# Altium schematic sheet STM32_DEV_Board_Connectors.SchDoc: STM32_DEV_Board_Connectors
size B; Organization: Myomo; Address1: 137 PORTLAND STREET, 4TH FLOOR; Address2: BOSTON, MA 02114; Address3: USA; SheetNumber: 6
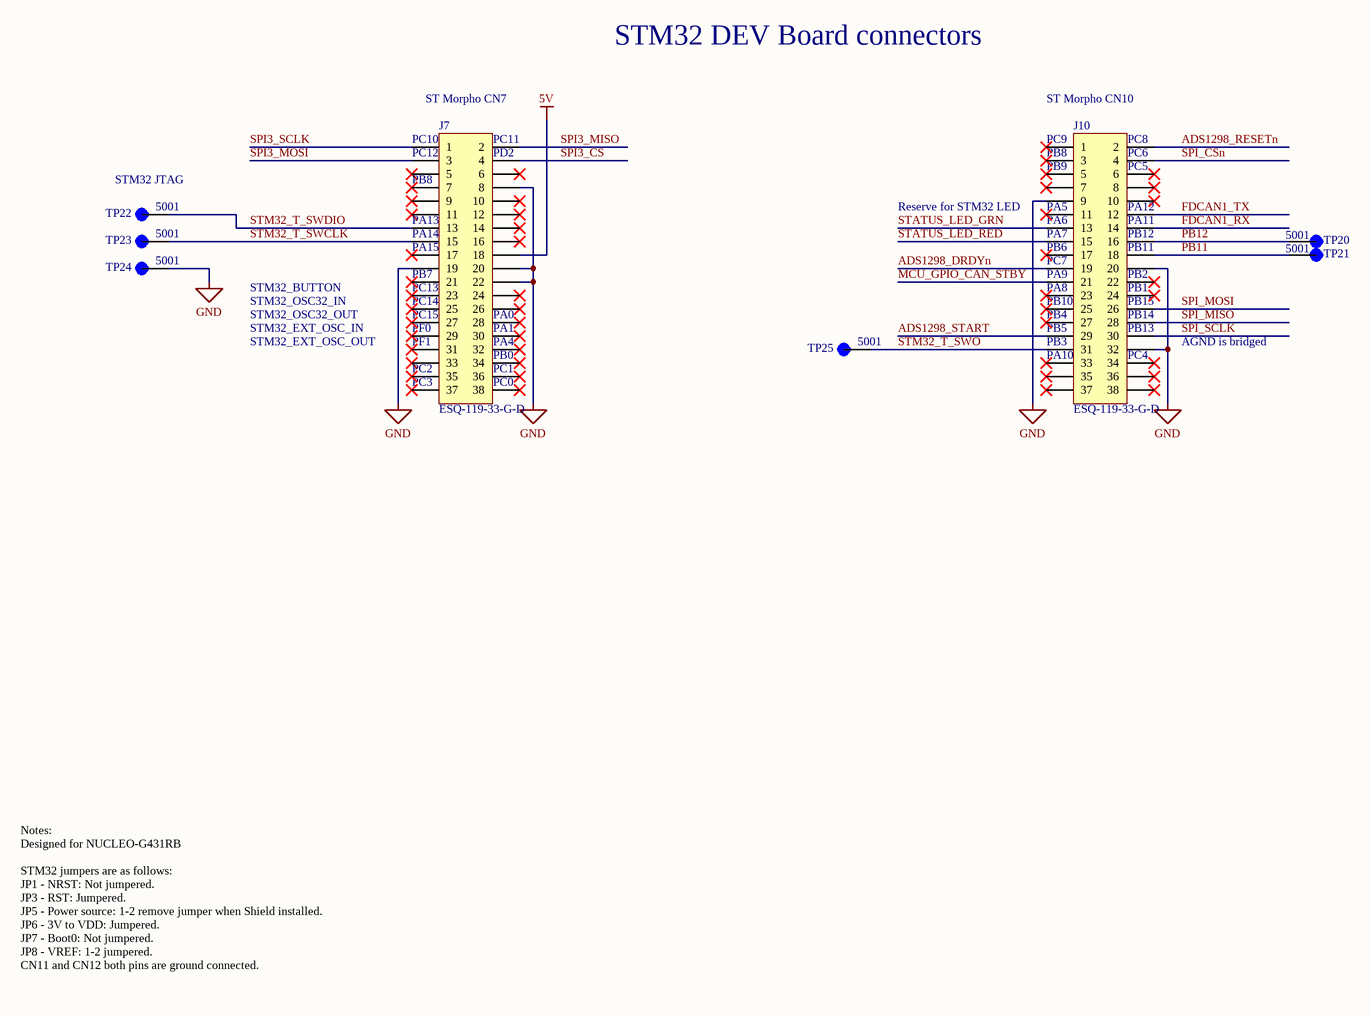
[diagram p0: STM32_DEV_Board_Connectors.SchDoc]

## Parts
J7  ESQ-119-33-G-D  [J_SAMTEC_ESQ-119-33-G-D]
J10  ESQ-119-33-G-D  [J_SAMTEC_ESQ-119-33-G-D]
TP20  5001  [TP_CLIP_BLK_5001]
TP21  5001  [TP_CLIP_BLK_5001]
TP22  5001  [TP_CLIP_BLK_5001]
TP23  5001  [TP_CLIP_BLK_5001]
TP24  5001  [TP_CLIP_BLK_5001]
TP25  5001  [TP_CLIP_BLK_5001]

## Nets
5V: J7.18
GND: J7.8 J7.19 J7.20 J7.22 J10.9 J10.20 J10.32 TP24.TP
ADS1298_DRDYn: J10.19
ADS1298_RESETn: J10.2
ADS1298_START: J10.29
FDCAN1_RX: J10.14
FDCAN1_TX: J10.12
MCU_GPIO_CAN_STBY: J10.21
PB11: J10.18 TP21.TP
PB12: J10.16 TP20.TP
SPI3_CS: J7.4
SPI3_MISO: J7.2
SPI3_MOSI: J7.3
SPI3_SCLK: J7.1
SPI_CSn: J10.4
SPI_MISO: J10.28
SPI_MOSI: J10.26
SPI_SCLK: J10.30
STATUS_LED_GRN: J10.13
STATUS_LED_RED: J10.15
STM32_T_SWCLK: J7.15 TP23.TP
STM32_T_SWDIO: J7.13 TP22.TP
STM32_T_SWO: J10.31 TP25.TP

Not connected (* = marked no-connect by the designer): J7 5* 6* 7* 9* 10* 11* 12* 14* 16* 17* 21* 23* 24* 25* 26* 27* 28* 29* 30* 31* 32* 33* 34* 35* 36* 37* 38*; J10 1* 3* 5* 6* 7* 8* 10* 11* 17* 22* 23* 24* 25* 27* 33* 34* 35* 36* 37* 38*

## Notes on the sheet
- STM32 DEV Board connectors
- (near J7) ST Morpho CN7
- (near J10) ST Morpho CN10
- (near TP22) STM32 JTAG
- (near J7) PC10
- (near J7) PC12
- (near J7) PB8
- (near J7) PC11
- (near J7) PD2
- (near J10) PC9
- (near J10) PB8
- (near J10) PB9
- (near J10) PC6
- (near J10) PC8
- (near J10) PC5
- (near J7) PA13
- (near J7) PA14
- (near J7) PA15
- (near J10) Reserve for STM32 LED
- (near J10) PC7
- (near J10) PA6
- (near J10) PA5
- (near J10) PA7
- (near J10) PB6
- (near J10) PA12
- (near J10) PA11
- (near J10) PB11
- (near J10) PB12
- STM32_BUTTON
- STM32_OSC32_IN
- STM32_EXT_OSC_IN
- STM32_OSC32_OUT
- (near J7) PC13
- (near J7) PC14
- (near J7) PC15
- (near J7) PF0
- (near J7) PB7
- (near J7) PA0
- (near J7) PA1
- (near J10) PA8
- (near J10) PA9
- (near J10) PB10
- (near J10) PB4
- (near J10) PB5
- (near J10) PB15
- (near J10) PB14
- (near J10) PB13
- (near J10) PB2
- (near J10) PB1
- STM32_EXT_OSC_OUT
- (near J7) PF1
- (near J7) PC2
- (near J7) PC3
- (near J7) PC0
- (near J7) PC1
- (near J7) PB0
- (near J7) PA4
- (near J10) PB3
- (near J10) PA10
- (near J10) PC4
- AGND is bridged
- Notes:
  Designed for NUCLEO-G431RB
  STM32 jumpers are as follows:
  JP1 - NRST: Not jumpered.
  JP3 - RST: Jumpered.
  JP5 - Power source: 1-2 remove jumper when Shield installed.
  JP6 - 3V to VDD: Jumpered.
  JP7 - Boot0: Not jumpered.
  JP8 - VREF: 1-2 jumpered.
  CN11 and CN12 both pins are ground connected.
- TITLE:
- NAME
- DATE
- PCA REVISION:
- PCA NAME:
- APPROVED BY:
- DESIGNED BY:
- PCA NUMBER:
- DATE:
- TIME:
- DOCUMENT SIZE:
- SHEET:
- OF
- B
- PROPRIETARY AND CONFIDENTIAL
  THIS DOCUMENT AND THE DATA CONTAINED HEREIN OR HEREWITH IS NOT TO BE REPRODUCED, USED, OR DISCLOSED, IN WHOLE OR IN PART, WITHOUT THE PERMISSION OF
  MYOMO, INC.

## Library data of the parts
J7 J10 = J_SAMTEC_ESQ-119-33-G-D: CONN SOCKET 38POS 0.1 GOLD PCB ELEVETED TH; MFG: Samtec; Myomo PN: 211-0009; MFGPN: ESQ-119-33-G-D; ComponentLink1Description: New link; ComponentLink1URL: *
TP20-TP25 = TP_CLIP_BLK_5001: PC TEST POINT MINIATURE BLACK; MFG: Keystone Electronics; Myomo PN: 213-0001; MFGPN: 5001